# EasyEDA schematic Strange V3_2021-09-19_20-10-57.json
TITLE: Sheet_1; REV: 1.0; Date: 2021-07-26; Sheet: 1/1; Drawn By: Whitney; Company: Your Company
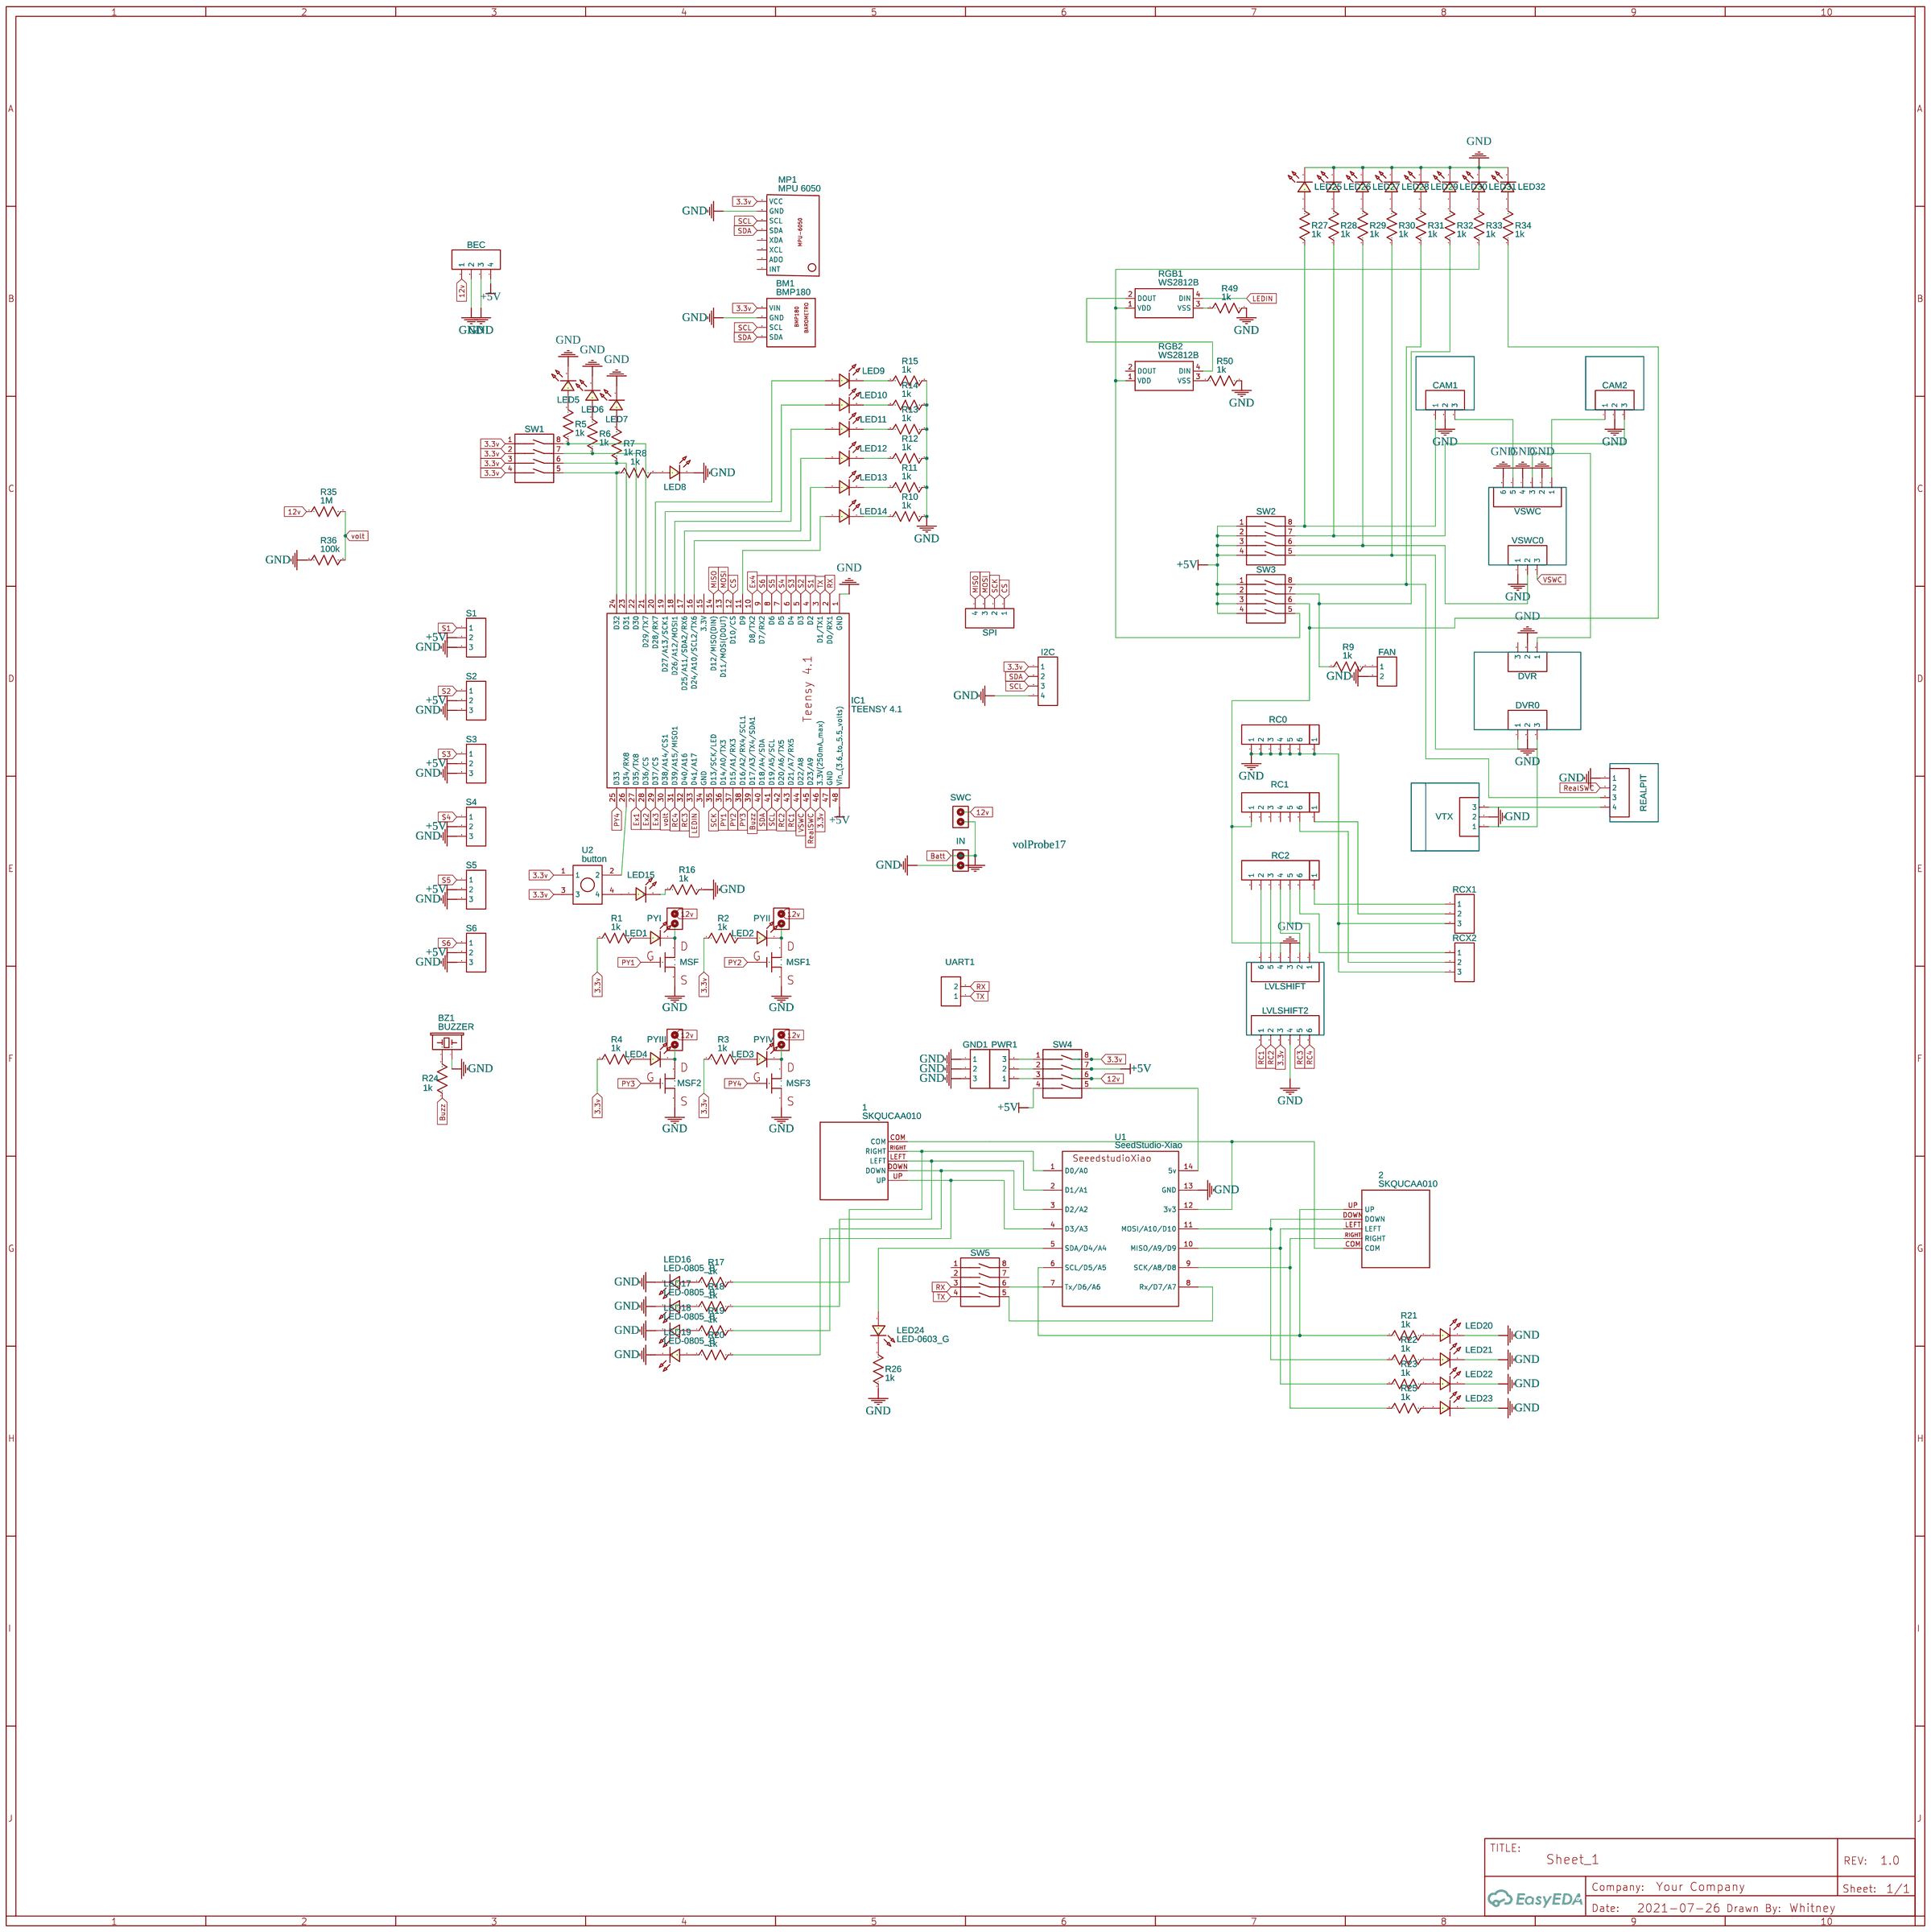
[diagram p0: schematic sheet]

## Parts
1  SKQUCAA010  [SKQUCAA010]
2  SKQUCAA010  [SKQUCAA010]
BEC  HDR-M-2.54_1x4  [HDR-M-2.54_1X4]
BM1  BMP180  [BMP180]
BZ1  BUZZER  [BUZZER-12MM-KIT]
CAM1  HDR-M-2.54_1x3  [HDR-M-2.54_1X3]
CAM2  HDR-M-2.54_1x3  [HDR-M-2.54_1X3]
DVR  HDR-M-2.54_1x3  [HDR-M-2.54_1X3]
DVR0  HDR-M-2.54_1x3  [HDR-M-2.54_1X3]
FAN  HDR-M-2.54_1x2  [HDR-M-2.54_1X2]
GND1  HDR-M-2.54_1x3  [HDR-M-2.54_1X3]
I2C  HDR-M-2.54_1x4  [HDR-M-2.54_1X4]
IC1  TEENSY 4.1  [TEENSY 4.1]
IN  Screw terminal 2x1  [SCREW_TERM_2X1]
J6  HDR-M-2.54_1x1  [HDR-M-2.54_1X1]
J10  HDR-M-2.54_1x1  [HDR-M-2.54_1X1]
J11  HDR-M-2.54_1x1  [HDR-M-2.54_1X1]
LED1  LED-0805_G  [LED0805_GREEN]
LED2  LED-0805_G  [LED0805_GREEN]
LED3  LED-0805_G  [LED0805_GREEN]
LED4  LED-0805_G  [LED0805_GREEN]
LED5  LED-0805_G  [LED0805_GREEN]
LED6  LED-0805_G  [LED0805_GREEN]
LED7  LED-0805_G  [LED0805_GREEN]
LED8  LED-0805_G  [LED0805_GREEN]
LED9  LED-0603_R  [LED0805_RED]
LED10  LED-0603_R  [LED0805_RED]
LED11  LED-0603_R  [LED0805_RED]
LED12  LED-0603_R  [LED0805_RED]
LED13  LED-0603_R  [LED0805_RED]
LED14  LED-0603_R  [LED0805_RED]
LED15  LED-0603_R  [LED0805_RED]
LED16  LED-0805_B  [LED0805_BLUE]
LED17  LED-0805_B  [LED0805_BLUE]
LED18  LED-0805_B  [LED0805_BLUE]
LED19  LED-0805_B  [LED0805_BLUE]
LED20  LED-0805_B  [LED0805_BLUE]
LED21  LED-0805_B  [LED0805_BLUE]
LED22  LED-0805_B  [LED0805_BLUE]
LED23  LED-0805_B  [LED0805_BLUE]
LED24  LED-0603_G  [LED0805_GREEN]
LED25  LED-TH-3mm_R  [LED-TH_BD3.0_RED]
LED26  LED-TH-3mm_R  [LED-TH_BD3.0_RED]
LED27  LED-TH-3mm_R  [LED-TH_BD3.0_RED]
LED28  LED-TH-3mm_R  [LED-TH_BD3.0_RED]
LED29  LED-TH-3mm_R  [LED-TH_BD3.0_RED]
LED30  LED-TH-3mm_R  [LED-TH_BD3.0_RED]
LED31  LED-TH-3mm_R  [LED-TH_BD3.0_RED]
LED32  LED-TH-3mm_R  [LED-TH_BD3.0_RED]
LVLSHIFT  HDR-M-2.54_1x6  [HDR-M-2.54_1X6]
LVLSHIFT2  HDR-M-2.54_1x6  [HDR-M-2.54_1X6]
MP1  MPU 6050  [MPU 6050]
MSF  RFP30N06LE  [TO-220AB]
MSF1  RFP30N06LE  [TO-220AB]
MSF2  RFP30N06LE  [TO-220AB]
MSF3  RFP30N06LE  [TO-220AB]
PWR1  HDR-M-2.54_1x3  [HDR-M-2.54_1X3]
PYI  Screw terminal 2x1  [SCREW_TERM_2X1]
PYII  Screw terminal 2x1  [SCREW_TERM_2X1]
PYIII  Screw terminal 2x1  [SCREW_TERM_2X1]
PYIV  Screw terminal 2x1  [SCREW_TERM_2X1]
R1  1k  [R_AXIAL-0.3]
R2  1k  [R_AXIAL-0.3]
R3  1k  [R_AXIAL-0.3]
R4  1k  [R_AXIAL-0.3]
R5  1k  [R_AXIAL-0.3]
R6  1k  [R_AXIAL-0.3]
R7  1k  [R_AXIAL-0.3]
R8  1k  [R_AXIAL-0.3]
R9  1k  [R_AXIAL-0.3]
R10  1k  [R_AXIAL-0.3]
R11  1k  [R_AXIAL-0.3]
R12  1k  [R_AXIAL-0.3]
R13  1k  [R_AXIAL-0.3]
R14  1k  [R_AXIAL-0.3]
R15  1k  [R_AXIAL-0.3]
R16  1k  [R_AXIAL-0.3]
R17  1k  [R0603]
R18  1k  [R0603]
R19  1k  [R0603]
R20  1k  [R0603]
R21  1k  [R0603]
R22  1k  [R0603]
R23  1k  [R0603]
R24  1k  [R_AXIAL-0.3]
R25  1k  [R0603]
R26  1k  [R0603]
R27  1k  [R_AXIAL-0.3]
R28  1k  [R_AXIAL-0.3]
R29  1k  [R_AXIAL-0.3]
R30  1k  [R_AXIAL-0.3]
R31  1k  [R_AXIAL-0.3]
R32  1k  [R_AXIAL-0.3]
R33  1k  [R_AXIAL-0.3]
R34  1k  [R_AXIAL-0.3]
R35  1M  [R_AXIAL-0.3]
R36  100k  [R_AXIAL-0.3]
R49  1k  [R0603]
R50  1k  [R0603]
RC0  HDR-M-2.54_1x6  [HDR-M-2.54_1X6]
RC1  HDR-M-2.54_1x6  [HDR-M-2.54_1X6]
RC2  HDR-M-2.54_1x6  [HDR-M-2.54_1X6]
RCX1  HDR-M-2.54_1x3  [HDR-M-2.54_1X3]
RCX2  HDR-M-2.54_1x3  [HDR-M-2.54_1X3]
REALPIT  HDR-M-2.54_1x4  [HDR-M-2.54_1X4]
RGB1  WS2812B  [WS2812B]
RGB2  WS2812B  [WS2812B]
S1  HDR-M-2.54_1x3  [HDR-M-2.54_1X3]
S2  HDR-M-2.54_1x3  [HDR-M-2.54_1X3]
S3  HDR-M-2.54_1x3  [HDR-M-2.54_1X3]
S4  HDR-M-2.54_1x3  [HDR-M-2.54_1X3]
S5  HDR-M-2.54_1x3  [HDR-M-2.54_1X3]
S6  HDR-M-2.54_1x3  [HDR-M-2.54_1X3]
SPI  HDR-M-2.54_1x4  [HDR-M-2.54_1X4]
SW1  208-4_4_POSITION_DIP_SWITCH  [SW-TH_DIP SWITCHEI-04]
SW2  208-4_4_POSITION_DIP_SWITCH  [SW-TH_DIP SWITCHEI-04]
SW3  208-4_4_POSITION_DIP_SWITCH  [SW-TH_DIP SWITCHEI-04]
SW4  208-4_4_POSITION_DIP_SWITCH  [SW-TH_DIP SWITCHEI-04]
SW5  208-4_4_POSITION_DIP_SWITCH  [SW-TH_DIP SWITCHEI-04]
SWC  Screw terminal 2x1  [SCREW_TERM_2X1]
U1  SeedStudio-Xiao  [XIAO_HOLES]
U2  button  [BUTTON DTS-6]
UART1  HDR-F-2.54_1x2  [HDR-F-2.54_1X2]
VSWC  HDR-M-2.54_1x6  [HDR-M-2.54_1X6]
VSWC0  HDR-M-2.54_1x3  [HDR-M-2.54_1X3]
VTX  HDR-M-2.54_1x3  [HDR-M-2.54_1X3]

## Library data of the parts
1 2 = SKQUCAA010: Contributor: KA1OS
BEC I2C REALPIT SPI = HDR-M-2.54_1x4: Supplier Part: C124378; Supplier: LCSC; Contributor: LCEDA_Lib
BM1 = BMP180: Contributor: waltertayler
BZ1 = BUZZER: Contributor: SparkFun
CAM1 CAM2 DVR DVR0 GND1 PWR1 RCX1 RCX2 S1-S6 VSWC0 VTX = HDR-M-2.54_1x3: Supplier Part: C180248; Supplier: LCSC; Contributor: LCEDA_Lib
FAN = HDR-M-2.54_1x2: Supplier Part: C124375; Supplier: LCSC; Contributor: LCEDA_Lib
IC1 = TEENSY 4.1: Manufacturer: PJRC; Manufacturer Part: Teensy 4.1; Supplier: Mouser; Supplier Part: 474-DEV-16771; link: https://www.mouser.fr/ProductDetail/474-DEV-16771; Contributor: jjmens
IN PYI PYII PYIII PYIV SWC = Screw terminal 2x1
J6 J10 J11 = HDR-M-2.54_1x1: Supplier Part: C81276; Supplier: LCSC; Contributor: LCEDA_Lib
LED1-LED8 = LED-0805_G: Manufacturer: 国星光电; Manufacturer Part: NCD0805G1; Supplier Part: C84260; Contributor: LCEDA_Lib
LED9-LED15 = LED-0603_R: Manufacturer: EVERLIGHT(台湾亿光); Manufacturer Part: 19-217/R6C-AL1M2VY/3T; Supplier Part: C72044; Supplier: LCSC; Contributor: LCEDA_01
LED16-LED23 = LED-0805_B: Manufacturer: 方舟 ARKLED; Manufacturer Part: D-B080508B1-KS2; Supplier Part: C108412; Contributor: LCEDA_Lib
LED24 = LED-0603_G: Manufacturer: EVERLIGHT(台湾亿光); Manufacturer Part: 19-217/GHC-YR1S2/3T; Supplier Part: C72043; Supplier: LCSC; Contributor: LCEDA_Lib
LED25-LED32 = LED-TH-3mm_R: Manufacturer: EVERLIGHT(台湾亿光); Manufacturer Part: 204-10SDRD/S530-A3-L; Supplier Part: C84774; Supplier: LCSC; Contributor: LCEDA_Lib
LVLSHIFT LVLSHIFT2 RC0-RC2 VSWC = HDR-M-2.54_1x6: Supplier Part: C190819; Supplier: LCSC; Contributor: LCEDA_Lib
MP1 = MPU 6050: Contributor: waltertayler
MSF MSF1-MSF3 = RFP30N06LE: 14A, 50V, 0.1 Ohm, N-Channel Power MOSFET; Contributor: dcp4435
R1-R16 R24 R27-R36 = R_AXIAL-0.3_US: Contributor: LCEDA_Lib
R17-R23 R25 R26 R49 R50 = R_0603_US: Contributor: LCEDA_Lib
RGB1 RGB2 = WS2812B: Contributor: SparkFun
SW1-SW5 = 208-4_4_POSITION_DIP_SWITCH: Supplier: Digi-Key; Manufacturer: DIP; Manufacturer Part: 208-4; Supplier Part: CT2084-ND; Contributor: 早馬悟司
U1 = SeedStudio-Xiao: Manufacturer: SeedStudio; Manufacturer Part: Xiao; Contributor: Siqo
U2 = button: Manufacturer Part: DTS-6(2); Contributor: futurenergy; Supplier Part: 78-1150; Supplier: Rapid; link: https://www.rapidonline.com/diptronics-dts-644k-square-button-through-hole-6-x-6mm-tactile-switch-100gf-78-1150
UART1 = HDR-F-2.54_1x2: Supplier Part: C49661; Supplier: LCSC; Contributor: LCEDA_Lib

## Nets
3.3v: BM1.VIN I2C.1 IC1.46(3.3V(250mA max)) LVLSHIFT2.3 MP1.VCC R1.1 R2.1 R3.1 R4.1 SW1.1 SW1.2 SW1.3 SW1.4 SW4.8 U2.1 U2.3
12v: BEC.1 PYI.1 PYII.1 PYIII.1 PYIV.1 R35.1 SW4.6 SWC.1
+5V: BEC.4 IC1.48(Vin (3.6 to 5.5 volts)) S1.2 S2.2 S3.2 S4.2 S5.2 S6.2 SW2.1 SW2.2 SW2.3 SW2.4 SW3.1 SW3.2 SW3.3 SW3.4 SW4.4 SW4.7
GND: BEC.2 BEC.3 BM1.GND BZ1.-(2) CAM1.2 CAM2.2 DVR.2 DVR0.2 FAN.2 GND1.1 GND1.2 GND1.3 I2C.4 IC1.1(GND) IN.2 J6.1 LED5.2 LED6.2 LED7.2 LED8.2 LED16.2 LED17.2 LED18.2 LED19.2 LED20.2 LED21.2 LED22.2 LED23.2 LED25.2 LED26.2 LED27.2 LED28.2 LED29.2 LED30.2 LED31.2 LED32.2 LVLSHIFT.3 LVLSHIFT2.4 MP1.GND MSF.3(S) MSF1.3(S) MSF2.3(S) MSF3.3(S) R10.2 R11.2 R12.2 R13.2 R14.2 R15.2 R16.2 R26.1 R36.1 R49.2 R50.2 RC0.1 RC0.2 RC0.3 RC0.4 RC0.5 RC0.6 RCX1.3 RCX2.3 REALPIT.1 S1.3 S2.3 S3.3 S4.3 S5.3 S6.3 U1.13(GND) VSWC.2 VSWC.4 VSWC.6 VSWC0.1 VTX.2
Batt: IN.1 SWC.2
Buzz: IC1.39(D17/A3/TX4/SDA1) R24.1
CS: IC1.12(D10/CS) SPI.1
Ex1: IC1.27(D35/TX8)
Ex2: IC1.28(D36/CS)
Ex3: IC1.29(D37/CS)
Ex4: IC1.10(D8/TX2)
LEDIN: IC1.33(D41/A17) RGB1.4(DIN)
MISO: IC1.14(D12/MISO(DIN)) SPI.4
MOSI: IC1.13(D11/MOSI(DOUT)) SPI.3
PY1: IC1.36(D14/A0/TX3) MSF.1(G)
PY2: IC1.37(D15/A1/RX3) MSF1.1(G)
PY3: IC1.38(D16/A2/RX4/SCL1) MSF2.1(G)
PY4: IC1.25(D33) MSF3.1(G)
RC1: IC1.43(D21/A7/RX5) LVLSHIFT2.1
RC2: IC1.42(D20/A6/TX5) LVLSHIFT2.2
RC3: IC1.32(D40/A16) LVLSHIFT2.5
RC4: IC1.31(D39/A15/MISO1) LVLSHIFT2.6
RealSWC: IC1.45(D23/A9) REALPIT.2
RX: IC1.2(D0/RX1) SW5.3 UART1.2
S1: IC1.4(D2) S1.1
S2: IC1.5(D3) S2.1
S3: IC1.6(D4) S3.1
S4: IC1.7(D5) S4.1
S5: IC1.8(D6) S5.1
S6: IC1.9(D7/RX2) S6.1
SCK: IC1.35(D13/SCK/LED) SPI.2
SCL: BM1.SCL I2C.3 IC1.41(D19/A5/SCL) MP1.SCL
SDA: BM1.SDA I2C.2 IC1.40(D18/A4/SDA) MP1.SDA
TX: IC1.3(D1/TX1) SW5.4 UART1.1
volt: IC1.30(D38/A14/CS1) R35.2 R36.2
VSWC: IC1.44(D22/A8) VSWC0.3
Net-(1-COM): 1.COM 2.COM U1.12(3v3)
Net-(1-DOWN): 1.DOWN R19.2 U1.3(D2/A2)
Net-(1-LEFT): 1.LEFT R18.2 U1.2(D1/A1)
Net-(1-RIGHT): 1.RIGHT R17.2 U1.1(D0/A0)
Net-(1-UP): 1.UP R20.2 U1.4(D3/A3)
Net-(2-DOWN): 2.DOWN R22.1 U1.11(MOSI/A10/D10)
Net-(2-LEFT): 2.LEFT R23.1 U1.10(MISO/A9/D9)
Net-(2-RIGHT): 2.RIGHT R25.1 U1.9(SCK/A8/D8)
Net-(2-UP): 2.UP R21.1 U1.6(SCL/D5/A5)
Net-(BZ1-+): BZ1.+(1) R24.2
Net-(CAM1-1): CAM1.1 R27.1 SW2.8
Net-(CAM1-3): CAM1.3 VSWC.5
Net-(CAM2-1): CAM2.1 VSWC.1
Net-(CAM2-3): CAM2.3 R28.1 SW2.7
Net-(DVR0-1): DVR0.1 R30.1 SW2.5
Net-(DVR0-3): DVR0.3 VTX.1
Net-(DVR-1): DVR.1 VSWC.3
Net-(FAN-1): FAN.1 R9.2
Net-(IC1-11): IC1.11(D9) LED14.1
Net-(IC1-16): IC1.16(D24/A10/SCL2/TX6) LED13.1
Net-(IC1-17): IC1.17(D25/A11/SDA2/RX6) LED12.1
Net-(IC1-18): IC1.18(D26/A12/MOSI1) LED11.1
Net-(IC1-19): IC1.19(D27/A13/SCK1) LED10.1
Net-(IC1-20): IC1.20(D28/RX7) LED9.1
Net-(IC1-21): IC1.21(D29/TX7) R5.1 SW1.8
Net-(IC1-22): IC1.22(D30) R6.1 SW1.7
Net-(IC1-23): IC1.23(D31) R7.1 SW1.6
Net-(IC1-24): IC1.24(D32) R8.1 SW1.5
Net-(IC1-26): IC1.26(D34/RX8) U2.2
Net-(J10-1): J10.1 RCX1.2
Net-(J11-1): J11.1 RCX1.1
Net-(LED1-1): LED1.1 R1.2
Net-(LED1-2): LED1.2 MSF.2(D) PYI.2
Net-(LED2-1): LED2.1 R2.2
Net-(LED2-2): LED2.2 MSF1.2(D) PYII.2
Net-(LED3-1): LED3.1 R3.2
Net-(LED3-2): LED3.2 MSF3.2(D) PYIV.2
Net-(LED4-1): LED4.1 R4.2
Net-(LED4-2): LED4.2 MSF2.2(D) PYIII.2
Net-(LED5-1): LED5.1 R5.2
Net-(LED6-1): LED6.1 R6.2
Net-(LED7-1): LED7.1 R7.2
Net-(LED8-1): LED8.1 R8.2
Net-(LED9-2): LED9.2 R15.1
Net-(LED10-2): LED10.2 R14.1
Net-(LED11-2): LED11.2 R13.1
Net-(LED12-2): LED12.2 R12.1
Net-(LED13-2): LED13.2 R11.1
Net-(LED14-2): LED14.2 R10.1
Net-(LED15-1): LED15.1 U2.4
Net-(LED15-2): LED15.2 R16.1
Net-(LED16-1): LED16.1 R17.1
Net-(LED17-1): LED17.1 R18.1
Net-(LED18-1): LED18.1 R19.1
Net-(LED19-1): LED19.1 R20.1
Net-(LED20-1): LED20.1 R21.2
Net-(LED21-1): LED21.1 R22.2
Net-(LED22-1): LED22.1 R23.2
Net-(LED23-1): LED23.1 R25.2
Net-(LED24-1): LED24.1 U1.5(SDA/D4/A4)
Net-(LED24-2): LED24.2 R26.2
Net-(LED25-1): LED25.1 R27.2
Net-(LED26-1): LED26.1 R28.2
Net-(LED27-1): LED27.1 R29.2
Net-(LED28-1): LED28.1 R30.2
Net-(LED29-1): LED29.1 R31.2
Net-(LED30-1): LED30.1 R32.2
Net-(LED31-1): LED31.1 R33.2
Net-(LED32-1): LED32.1 R34.2
Net-(LVLSHIFT-1): LVLSHIFT.1 RC2.5
Net-(LVLSHIFT-2): LVLSHIFT.2 RC2.4
Net-(LVLSHIFT-4): LVLSHIFT.4 R34.1 RC1.1 SW3.6
Net-(LVLSHIFT-5): LVLSHIFT.5 RC2.3
Net-(LVLSHIFT-6): LVLSHIFT.6 RC2.2
Net-(PWR1-1): PWR1.1 SW4.3
Net-(PWR1-2): PWR1.2 SW4.2
Net-(PWR1-3): PWR1.3 SW4.1
Net-(R9-1): R9.1 R32.1 SW3.7
Net-(R29-1): R29.1 SW2.6 VSWC0.2
Net-(R31-1): R31.1 REALPIT.3 SW3.8
Net-(R33-1): R33.1 RGB1.1(VDD) RGB2.1(VDD) SW3.5
Net-(R49-1): R49.1 RGB1.3(VSS)
Net-(R50-1): R50.1 RGB2.3(VSS)
Net-(RC1-6): RC1.6 RCX2.2
Net-(RC2-6): RC2.6 RCX2.1
Net-(REALPIT-4): REALPIT.4 VTX.3
Net-(RGB1-2): RGB1.2(DOUT) RGB2.4(DIN)
Net-(SW4-5): SW4.5 U1.14(5v)
Net-(SW5-5): SW5.5 U1.8(Rx/D7/A7)
Net-(SW5-6): SW5.6 U1.7(Tx/D6/A6)

Not connected (* = marked no-connect by the designer): DVR 3; IC1 15(3.3V) 34(GND) 47(GND); MP1 ADO INT XCL XDA; RC1 2 3 4 5; RC2 1; RGB2 2(DOUT); SW5 1 2 7 8
